# EAGLE schematic GiGaMega_uneversal (EAGLE 7.6.0)

## Sheet 1 of 2
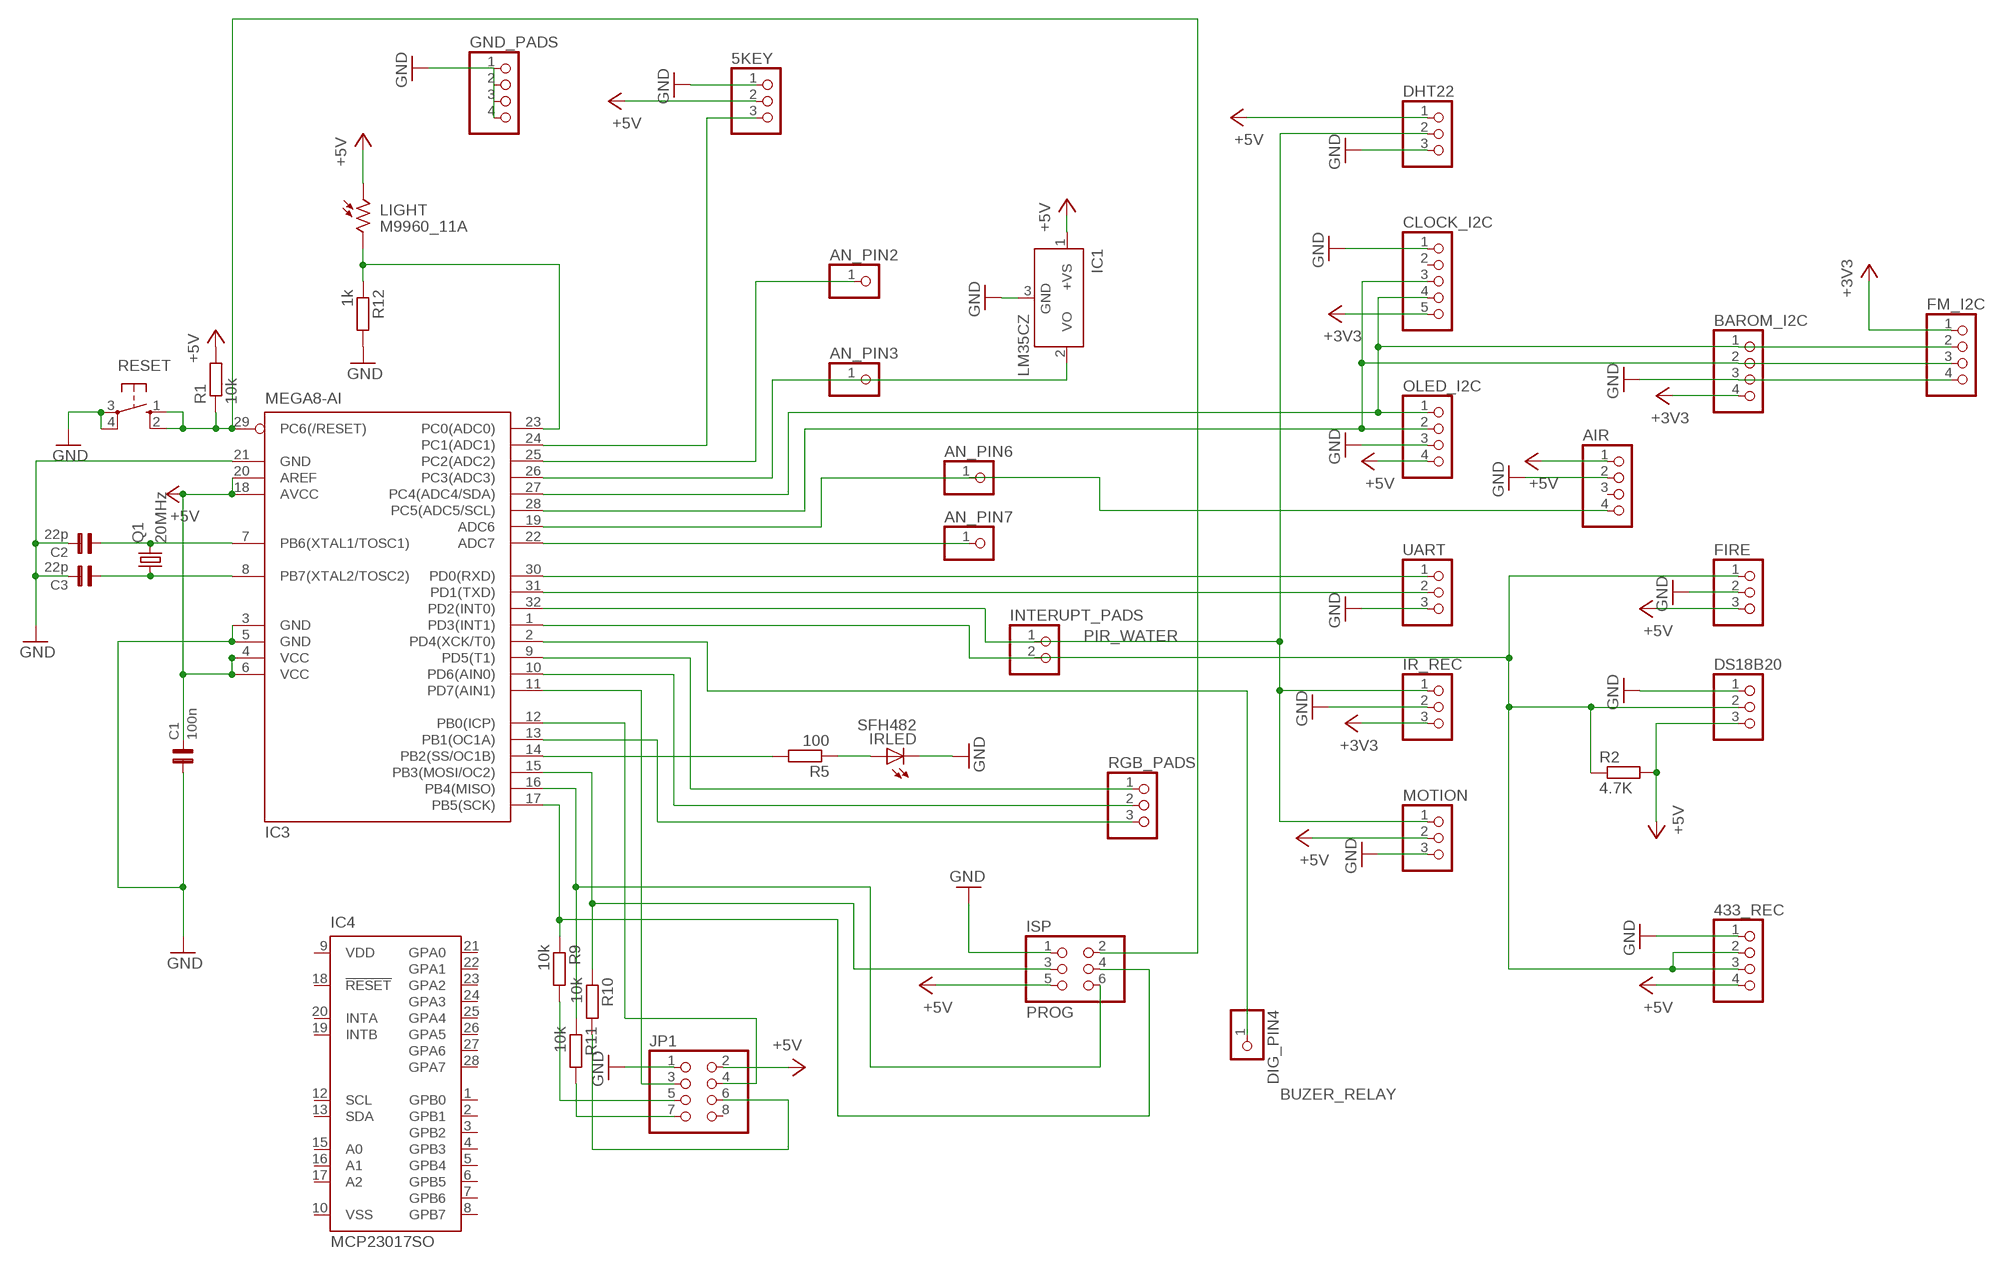
[diagram p0: schematic, sheet 1]

### Parts
5KEY  PINHD-1X3  [1X03]
433_REC  PINHD-1X4  [1X04]
AIR  PINHD-1X4  [1X04]
AN_PIN2  PINHD-1X1  [1X01]
AN_PIN3  PINHD-1X1  [1X01]
AN_PIN6  PINHD-1X1  [1X01]
AN_PIN7  PINHD-1X1  [1X01]
BAROM_I2C  PINHD-1X4  [1X04]
C1  100n  C1206  [1206]
C2  22p  C1206  [1206]
C3  22p  C1206  [1206]
CLOCK_I2C  PINHD-1X5  [1X05]
DHT22  PINHD-1X3  [1X03]
DIG_PIN4  PINHD-1X1  [1X01]
DS18B20  PINHD-1X3  [1X03]
FIRE  PINHD-1X3  [1X03]
FM_I2C  PINHD-1X4  [1X04]
GND_PADS  PINHD-1X4  [1X04]
IC1  LM35CZ  [TO92]
IC3  MEGA8-AI  [TQFP32-08]
IC4  MCP23017SO  [SO28W]
INTERUPT_PADS  PINHD-1X2  [1X02]
IR_REC  PINHD-1X3  [1X03]
IRLED  SFH482  [SFH482]
ISP  PROG  PINHD-2X3  [2X03]
JP1  PINHD-2X4  [2X04]
LIGHT  M9960_11A  [M9960]
MOTION  PINHD-1X3  [1X03]
OLED_I2C  PINHD-1X4  [1X04]
Q1  20MHz  CRYSTALHC49UP  [HC49UP]
R1  10k  R-EU_R1206  [R1206]
R2  4.7K  R-EU_R1206  [R1206]
R5  100  R-EU_R1206  [R1206]
R9  10k  R-EU_R1206  [R1206]
R10  10k  R-EU_R1206  [R1206]
R11  10k  R-EU_R1206  [R1206]
R12  1k  R-EU_R1206  [R1206]
RESET  10-XX  [B3F-10XX]
RGB_PADS  PINHD-1X3  [1X03]
UART  PINHD-1X3  [1X03]

### Nets
+3V3: BAROM_I2C.4 CLOCK_I2C.5 FM_I2C.1 IR_REC.3
+5V: 5KEY.2 433_REC.4 AIR.1 C1.2 DHT22.1 DS18B20.3 FIRE.3 IC1.1(+VS) IC3.4(VCC) IC3.6(VCC) IC3.18(AVCC) IC3.20(AREF) ISP.5 JP1.2 LIGHT.1 MOTION.2 OLED_I2C.4 R1.2 R2.2
BUZER_RELAY: DIG_PIN4.1 IC3.2(PD4(XCK/T0))
GND: 5KEY.1 433_REC.1 AIR.2 BAROM_I2C.3 C1.1 C2.2 C3.2 CLOCK_I2C.1 DHT22.3 DS18B20.1 FIRE.2 FM_I2C.4 GND_PADS.1 GND_PADS.2 GND_PADS.3 GND_PADS.4 IC1.3(GND) IC3.3(GND) IC3.5(GND) IC3.21(GND) IR_REC.2 IRLED.K(C) ISP.1 JP1.1 MOTION.3 OLED_I2C.3 R12.2 RESET.3(P) RESET.4(P1) UART.3 ; also sheet 2
KEY_PIN24: 5KEY.3 IC3.24(PC1(ADC1))
MISO: IC3.16(PB4(MISO)) ISP.6 R11.1
MOSI: IC3.15(PB3(MOSI/OC2)) ISP.3 R10.1
N$1: AN_PIN2.1 IC3.25(PC2(ADC2))
N$24: JP1.6 R10.2
N$25: JP1.7 R11.2
N$30: JP1.5 R9.2
PIN1_IRLED: IRLED.A R5.1
PIN2: IC3.9(PD5(T1)) RGB_PADS.1
PIN7: C2.1 IC3.7(PB6(XTAL1/TOSC1)) Q1.2
PIN8: C3.1 IC3.8(PB7(XTAL2/TOSC2)) Q1.1
PIN9: IC3.10(PD6(AIN0)) RGB_PADS.2
PIN10: IC3.13(PB1(OC1A)) RGB_PADS.3
PIN11: IC3.11(PD7(AIN1)) JP1.3
PIN12: IC3.12(PB0(ICP)) JP1.4
PIN14: IC3.14(PB2(SS/OC1B)) R5.2
PIN19: AIR.4 AN_PIN6.1 IC3.19(ADC6)
PIN22: AN_PIN7.1 IC3.22(ADC7)
PIN23: IC3.23(PC0(ADC0)) LIGHT.2 R12.1
PIR_: AN_PIN3.1 IC1.2(VO) IC3.26(PC3(ADC3))
PIR_WATER: DHT22.2 IC3.32(PD2(INT0)) INTERUPT_PADS.1 IR_REC.1 MOTION.1
RELAY_IRREC: 433_REC.2 433_REC.3 DS18B20.2 FIRE.1 IC3.1(PD3(INT1)) INTERUPT_PADS.2 R2.1
RESET: IC3.29(PC6(/RESET)) ISP.2 R1.1 RESET.1(S) RESET.2(S1)
RX: IC3.30(PD0(RXD)) UART.1
SCK: IC3.17(PB5(SCK)) ISP.4 R9.1
SCL: BAROM_I2C.2 CLOCK_I2C.3 FM_I2C.3 IC3.28(PC5(ADC5/SCL)) OLED_I2C.2
SDA: BAROM_I2C.1 CLOCK_I2C.4 FM_I2C.2 IC3.27(PC4(ADC4/SDA)) OLED_I2C.1
TX: IC3.31(PD1(TXD)) UART.2
Unconnected: AIR.3 CLOCK_I2C.2 IC4.1(GPB0) IC4.2(GPB1) IC4.3(GPB2) IC4.4(GPB3) IC4.5(GPB4) IC4.6(GPB5) IC4.7(GPB6) IC4.8(GPB7) IC4.12(SCL) IC4.13(SDA) IC4.15(A0) IC4.16(A1) IC4.17(A2) IC4.18(!RESET) IC4.19(INTB) IC4.20(INTA) IC4.21(GPA0) IC4.22(GPA1) IC4.23(GPA2) IC4.24(GPA3) IC4.25(GPA4) IC4.26(GPA5) IC4.27(GPA6) IC4.28(GPA7) JP1.8

## Sheet 2 of 2
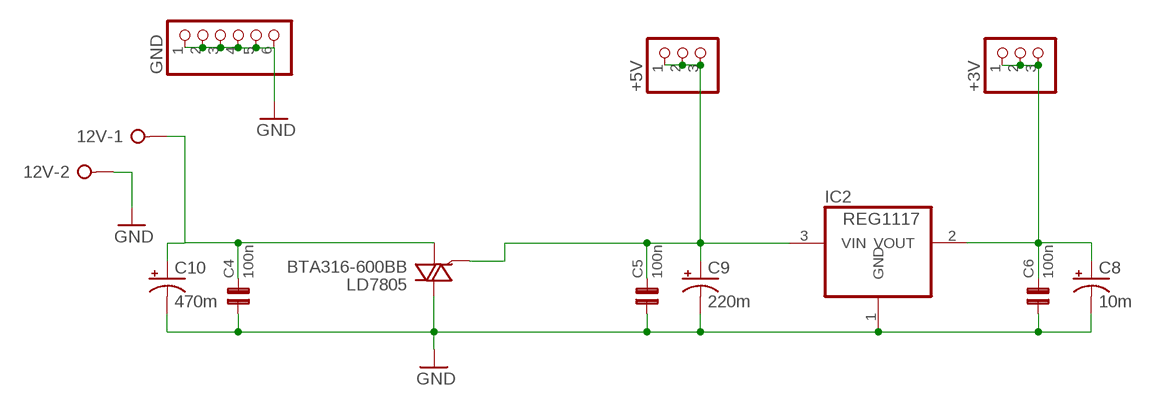
[diagram p1: schematic, sheet 2]

### Parts
12V  W237-02P  [W237-132]
+3V  PINHD-1X3  [1X03]
+5V  PINHD-1X3  [1X03]
C4  100n  C1206  [1206]
C5  100n  C1206  [1206]
C6  100n  C1206  [1206]
C8  10m  CPOL-USUD-4X5,8  [UD-4X5,8_NICHICON]
C9  220m  CPOL-USUD-6,3X7,7  [UD-6,3X7,7_NICHICON]
C10  470m  CPOL-USUD-10X10  [UD-10X10_NICHICON]
GND  PINHD-1X6  [1X06]
IC2  REG1117  [SOT223]
LD7805  BTA316-600BB  [SOT404]

### Nets
+3: +3V.1 +3V.2 +3V.3 C6.2 C8.+ IC2.2(VOUT)
+5: +5V.1 +5V.2 +5V.3 C5.2 C9.+ IC2.3(VIN) LD7805.3(G)
+12: 12V.1 C4.2 C10.+ LD7805.1(CM)
GND: 12V.2 C4.1 C5.1 C6.1 C8.- C9.- C10.- GND.1 GND.2 GND.3 GND.4 GND.5 GND.6 IC2.1(GND) LD7805.MB(LD) ; also sheet 1

## Power pins joined to a net without a drawn wire
VDD: IC4.9(VDD)
VSS: IC4.10(VSS)

## Library data of the parts
5KEY +3V +5V DHT22 DS18B20 FIRE IR_REC MOTION RGB_PADS UART = pinhead:PINHD-1X3: PIN HEADER
12V = con-wago-508:W237-02P: WAGO SREW CLAMP; OC_FARNELL: unknown; OC_NEWARK: unknown
433_REC AIR BAROM_I2C FM_I2C GND_PADS OLED_I2C = pinhead:PINHD-1X4: PIN HEADER
AN_PIN2 AN_PIN3 AN_PIN6 AN_PIN7 DIG_PIN4 = pinhead:PINHD-1X1: PIN HEADER
C1-C6 = capsmd:C1206
C8-C10 = rcl:CPOL-US: POLARIZED CAPACITOR, American symbol
CLOCK_I2C = pinhead:PINHD-1X5: PIN HEADER
GND = pinhead:PINHD-1X6: PIN HEADER
IC1 = lm35:LM35: Single-Supply Centigrade Temperature Sensor Vout = (10mV/°C x Temp °C) +5mmmV Source: http://www.national.com/ds/LM/LM35.pdf
IC2 = burr-brown:REG1117: 800mA and 1A Low Dropout (LDO) Positive Regulator 1.8V, 2.5V, 2.85V, 3.3V, 5V, and Adj; MPN: REG1117; OC_FARNELL: 1097566; OC_NEWARK: 14P6981
IC3 = atmel:MEGA8: MICROCONTROLLER 8 Kbytes FLASH, 1 kbytes SRAM, 512 bytes EEPROM, USART, 6-channel 10 bit ADC, 2-channel 8 bit ADC Pin compatible with Atmega48, ATMega88, ATMega168 Source: avr.lbr; MPN: ATMEGA8-16AU; OC_FARNELL: 9171371; OC_NEWARK: 73M8863
IC4 = microchip:MCP23017: http://ww1.microchip.com/downloads/en/DeviceDoc/21952a.pdf Source: http://ww1.microchip.com/downloads/en/DeviceDoc/21952a.pdf; MF: MICROCHIP; MPN: MCP23017-E/SO; OC_FARNELL: 1332087; OC_NEWARK: 31K2958
INTERUPT_PADS = pinhead:PINHD-1X2: PIN HEADER
IRLED = led:SFH482: IR LED infrared emitting diode, Infineon
ISP = pinhead:PINHD-2X3: PIN HEADER
JP1 = pinhead:PINHD-2X4: PIN HEADER
LD7805 = nxp_60:BTA316: Planar passivated high commutation three quadrant triac in a SOT78 plastic package intended for use in circuits where high static and dynamic dV/dt and high dI/dt can occur AAL Eindhoven MV+ MK; 12NC: 9340 601 04118
LIGHT = photo-elements:M9960_11: Photo Sensor Beacon Light, Photometer Applications Source: http://optoelectronics.perkinelmer.com/content/Datasheets/DTS_M9960.pdf
Q1 = crystal:CRYSTAL: CRYSTAL; OC_FARNELL: unknown; OC_NEWARK: unknown
R1 R2 R5 R9-R12 = rcl:R-EU_: RESISTOR, European symbol
RESET = switch-omron:10-XX: OMRON SWITCH; MPN: B3F-1000; OC_FARNELL: 176432; OC_NEWARK: 36M3542